# Altium schematic sheet WL-RF-SBORKA.SchDoc: Структурная схема RF_UNIT
size 420 x 297 mm; Author: UA3REO; CompanyName: WOLF-RF-UNIT; DocumentNumber: WOLF-RF_UNIT; SheetNumber: 1
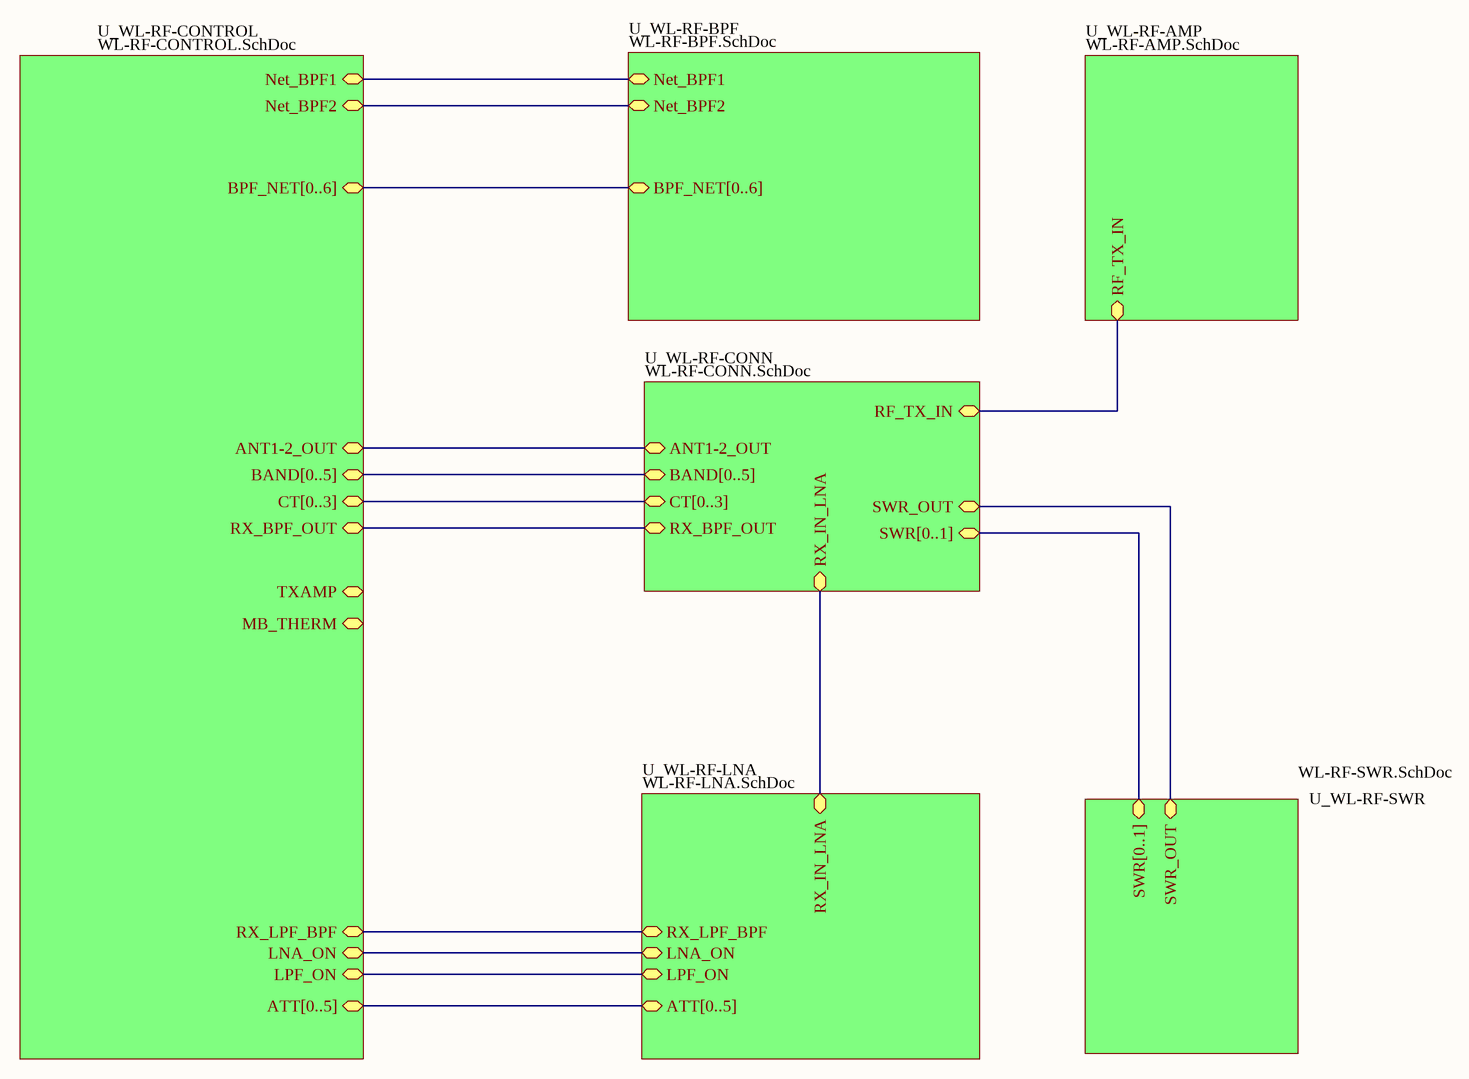
[diagram p0: WL-RF-SBORKA.SchDoc]

## Sub-sheets
U_WL-RF-AMP = WL-RF-AMP.SchDoc: RF_TX_IN (bidir)
U_WL-RF-BPF = WL-RF-BPF.SchDoc: BPF_NET[0..6] (bidir), Net_BPF2 (bidir), Net_BPF1 (bidir)
U_WL-RF-CONN = WL-RF-CONN.SchDoc: RX_IN_LNA (bidir), RX_BPF_OUT (bidir), RF_TX_IN (bidir), BAND[0..5] (bidir), CT[0..3] (bidir), ANT1-2_OUT (bidir), SWR[0..1] (bidir), SWR_OUT (bidir)
U_WL-RF-CONTROL = WL-RF-CONTROL.SchDoc: Net_BPF1 (bidir), Net_BPF2 (bidir), BPF_NET[0..6] (bidir), ATT[0..5] (bidir), LPF_ON (bidir), LNA_ON (bidir), RX_LPF_BPF (bidir), MB_THERM (bidir), ANT1-2_OUT (bidir), RX_BPF_OUT (bidir), BAND[0..5] (bidir), CT[0..3] (bidir), TXAMP (bidir)
U_WL-RF-LNA = WL-RF-LNA.SchDoc: LNA_ON (bidir), RX_IN_LNA (bidir), LPF_ON (bidir), RX_LPF_BPF (bidir), ATT[0..5] (bidir)
U_WL-RF-SWR = WL-RF-SWR.SchDoc: SWR_OUT (bidir), SWR[0..1] (bidir)

## Nets
(unnamed): sheet U_WL-RF-BPF/Net_BPF2, sheet U_WL-RF-CONTROL/Net_BPF2
(unnamed): sheet U_WL-RF-BPF/Net_BPF1, sheet U_WL-RF-CONTROL/Net_BPF1
(unnamed): sheet U_WL-RF-CONTROL/LPF_ON, sheet U_WL-RF-LNA/LPF_ON
(unnamed): sheet U_WL-RF-CONTROL/LNA_ON, sheet U_WL-RF-LNA/LNA_ON
(unnamed): sheet U_WL-RF-CONTROL/RX_LPF_BPF, sheet U_WL-RF-LNA/RX_LPF_BPF
(unnamed): sheet U_WL-RF-CONTROL/ANT1-2_OUT, sheet U_WL-RF-CONN/ANT1-2_OUT
(unnamed): sheet U_WL-RF-CONTROL/RX_BPF_OUT, sheet U_WL-RF-CONN/RX_BPF_OUT
(unnamed): sheet U_WL-RF-LNA/RX_IN_LNA, sheet U_WL-RF-CONN/RX_IN_LNA
(unnamed): sheet U_WL-RF-CONN/RF_TX_IN, sheet U_WL-RF-AMP/RF_TX_IN
(unnamed): sheet U_WL-RF-CONN/SWR_OUT, sheet U_WL-RF-SWR/SWR_OUT

## Buses and harness runs
bus sheet U_WL-RF-BPF/BPF_NET[0..6] = sheet U_WL-RF-CONTROL/BPF_NET[0..6]
bus sheet U_WL-RF-CONN/BAND[0..5] = sheet U_WL-RF-CONTROL/BAND[0..5]
bus sheet U_WL-RF-CONN/CT[0..3] = sheet U_WL-RF-CONTROL/CT[0..3]
bus sheet U_WL-RF-CONN/SWR[0..1] = sheet U_WL-RF-SWR/SWR[0..1]
bus sheet U_WL-RF-CONTROL/ATT[0..5] = sheet U_WL-RF-LNA/ATT[0..5]

## Notes on the sheet
- Перв. примен.
- Справ. №
- Подп. и дата
- Инв. № дубл.
- Взам. инв. №
- Разраб.
- Изм.
- Лист
- № докум.
- Подп.
- Дата
- Лит.
- Масса
- Масштаб
- Пров.
- Т.контр.
- Листов
- Инв. № подл.
- Утв.
- Н.контр.
- 2.106-A3
- Копировал
- Формат А3